# Altium schematic sheet Gate Level Translator.SchDoc
size 406 x 304 mm; SheetNumber: 19; SheetTotal: 19
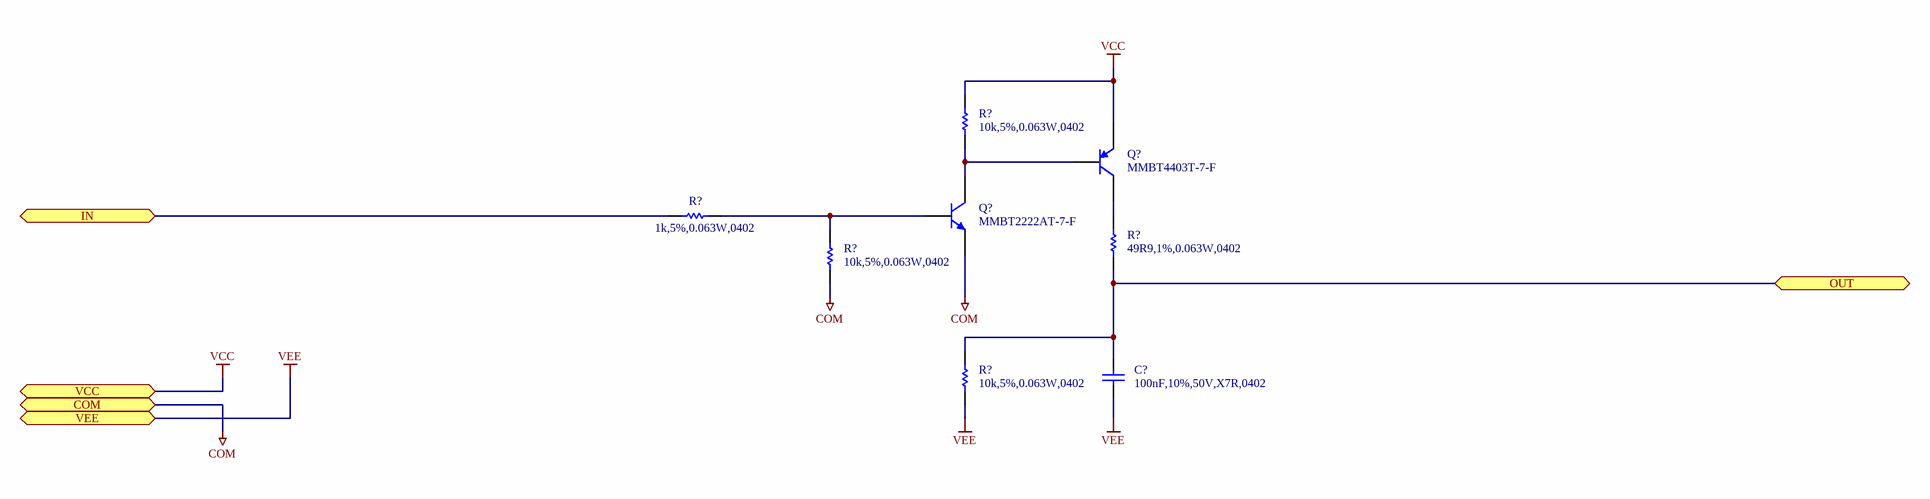
[diagram p0: Gate Level Translator.SchDoc]

## Parts
(Parts that share a designator on the sheet are numbered #1, #2 ... from top to bottom, then left to right.)
C?  100nF,10%,50V,X7R,0402  [CAPC1005X06N]
Q?#1  MMBT4403T-7-F  [DIODES_SOT523]
Q?#2  MMBT2222AT-7-F  [SOTFL50P160X90-3N]
R?#1  10k,5%,0.063W,0402  [RESC1005X04N]
R?#2  1k,5%,0.063W,0402  [RESC1005X04N]
R?#3  49R9,1%,0.063W,0402  [RESC1005X04N]
R?#4  10k,5%,0.063W,0402  [RESC1005X04N]
R?#5  10k,5%,0.063W,0402  [RESC1005X04N]

## Ports
COM (bidir), IN (bidir), OUT (bidir), VCC (bidir), VEE (bidir)

## Nets
COM: Q?#2.2(E) R?#4.1 ; port COM
VCC: Q?#1.2(E) R?#1.2 ; port VCC
VEE: C?.1 R?#5.1 ; port VEE
IN: R?#2.1 ; port IN
OUT: C?.2 R?#3.1 R?#5.2 ; port OUT
NetQ?#1_1: Q?#1.1(B) Q?#2.3(C) R?#1.1
NetQ?#1_3: Q?#1.3(C) R?#3.2
NetQ?#2_1: Q?#2.1(B) R?#2.2 R?#4.2

## Notes on the sheet
- Rev
- Sheet Name:
- Date:
- Sheet
- Designer:
- of

## Library data of the parts
C? = CAP,Cer,100nF,10%,50V,X7R,0402: 50V 100nF X7R Â±10% 0402 Ceramic Capacitors ROHS; Manufacturer 1: Murata; Manufacturer 1 Part Number: GRM155R71H104KE14D; Vendor 1 Part Number: C77020; Vendor 1: LCSC; Value: 100n; Part Name: CAP,Cer,100nF,10%,50V,X7R,0402; CreatedBy: Judd Foster; HelpURL: https://www.lcsc.com/datasheet/C77020.pdf
Q?#1 = Trans,PNP,40V,600mA,SOT523: Bipolar (BJT) Transistor PNP 40 V 600 mA 200MHz 150 mW Surface Mount SOT-523; Manufacturer 1: Diodes Incorporated; Vendor 1 Part Number: MMBT4403T-FDICT-ND; Vendor 1: Digikey; Part Name: Trans,PNP,40V,600mA,SOT523; CreatedBy: Judd Foster; HelpURL: https://www.diodes.com/assets/Datasheets/ds30273.pdf; Manufacturer 1 Part Number: MMBT4403T-7-F
Q?#2 = Trans,NPN,40V,600mA,SOT523: Bipolar (BJT) Transistor NPN 40 V 600 mA 300MHz 150 mW Surface Mount SOT-523; Manufacturer 1: Diodes Incorporated; Vendor 1 Part Number: MMBT2222AT-FDICT-ND; Vendor 1: Digikey; Part Name: Trans,NPN,40V,600mA,SOT523; CreatedBy: Judd Foster; HelpURL: https://media.digikey.com/pdf/Data%20Sheets/Diodes%20PDFs/MMBT2222AT_Rev2016.pdf; Manufacturer 1 Part Number: MMBT2222AT-7-F
R?#1 R?#4 R?#5 = RES,10k,5%,0.063W,0402: 10 kOhms ï¿½5% 0.063W, 1/16W Chip Resistor 0402 (1005 Metric) Automotive AEC-Q200 Thick Film; Manufacturer 1: Stackpole Electronics Inc; Manufacturer 1 Part Number: RMCF0402JT10K0; Vendor 1 Part Number: RMCF0402JT10K0CT-ND; Vendor 1: DIgikey; Part Name: RES,10k,5%,0.063W,0402; CreatedBy: Judd Foster; HelpURL: https://www.seielect.com/catalog/sei-rmcf_rmcp.pdf; Value: 10k
R?#2 = RES,1k,5%,0.063W,0402: 1 kOhms ï¿½5% 0.063W, 1/16W Chip Resistor 0402 (1005 Metric) Automotive AEC-Q200 Thick Film; Manufacturer 1: Stackpole Electronics Inc; Manufacturer 1 Part Number: RMCF0402JT1K00; Vendor 1 Part Number: RMCF0402JT1K00CT-ND; Vendor 1: DIgikey; Part Name: RES,1k,5%,0.063W,0402; CreatedBy: Judd Foster; HelpURL: https://www.seielect.com/catalog/sei-rmcf_rmcp.pdf; Value: 1k
R?#3 = RES,49R9,1%,0.063W,0402: 49.9 Ohms Â±1% 0.063W, 1/16W Chip Resistor 0402 (1005 Metric) Moisture Resistant Thick Film; Manufacturer 1: YAGEO; Manufacturer 1 Part Number: RC0402FR-0749R9L; Vendor 1 Part Number: 311-49.9LRCT-ND; Vendor 1: DigiKey; Value: 49.9; Part Name: RES,49R9,1%,0.063W,0402; CreatedBy: Judd Foster; HelpURL: https://www.yageo.com/upload/media/product/products/datasheet/rchip/PYu-RC_Group_51_RoHS_L_12.pdf